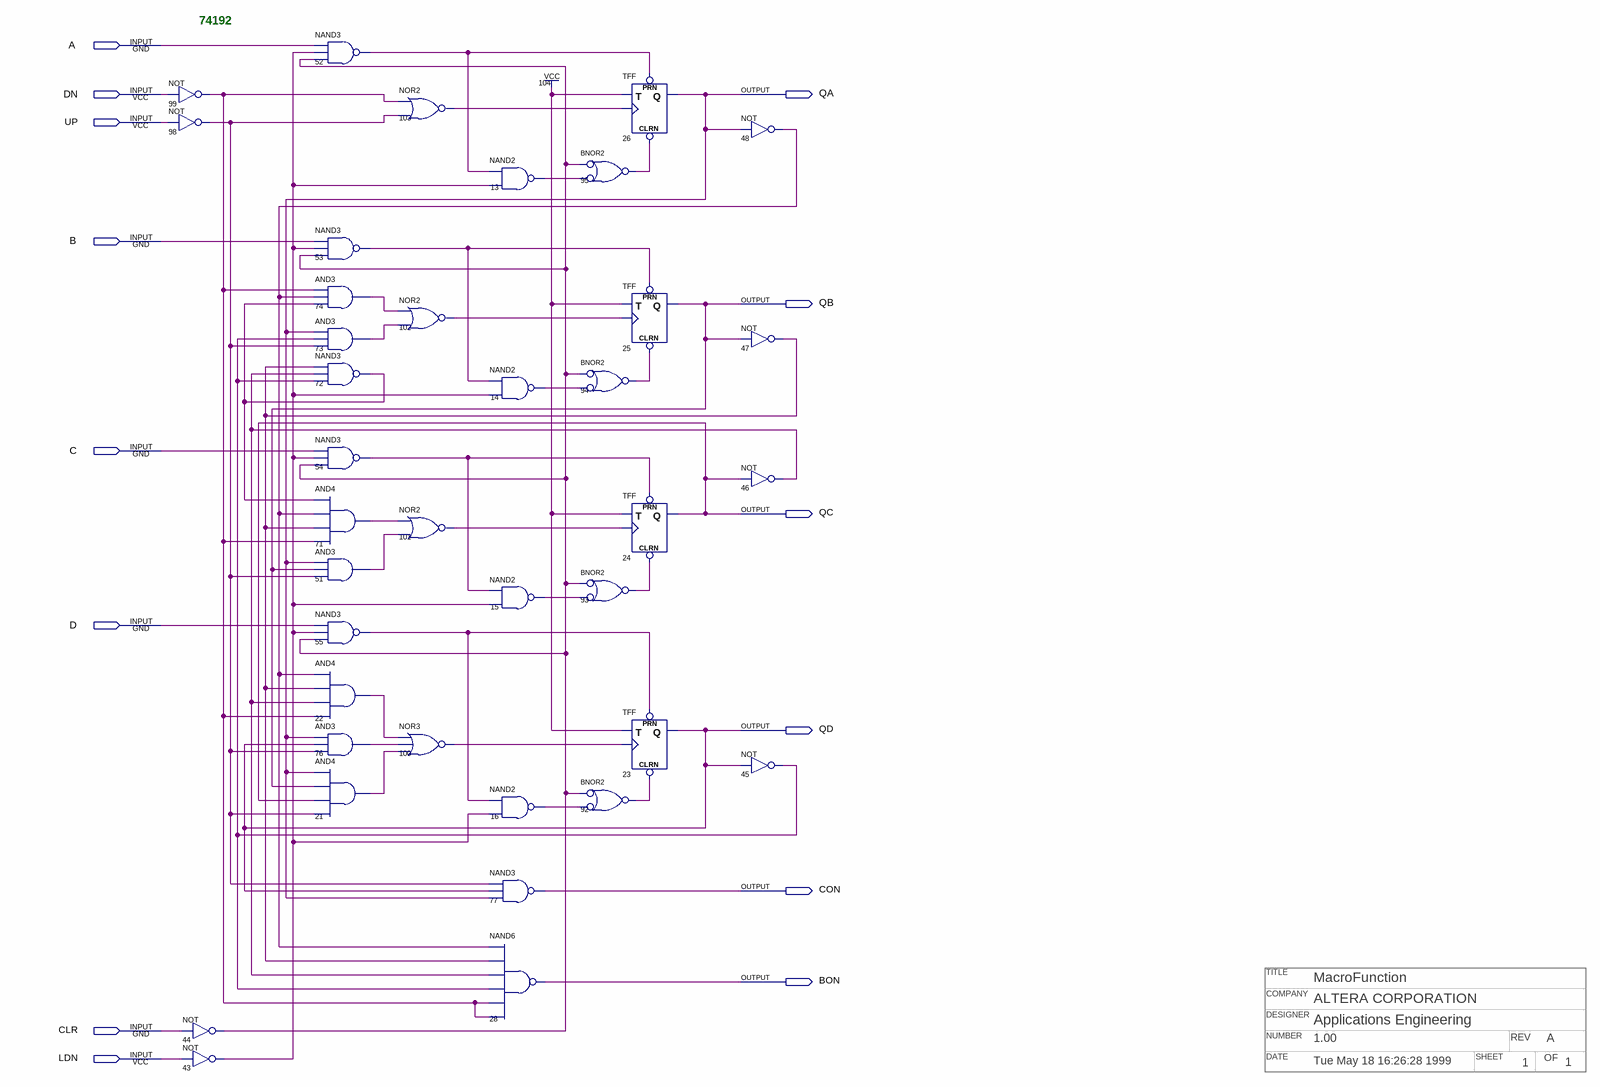
[diagram p0: schematic sheet]
// Quartus schematic 74192.bdf as structural Verilog: 38 symbols, 14 pins
// Title block: TITLE: MacroFunction; COMPANY: ALTERA CORPORATION; DESIGNER: Applications Engineering; NUMBER: 1.00; REV: A; DATE: Tue May 18 16:26:28 1999; SHEET: 1; OF: 1
module \74192  (
  input  A,
  input  DN,
  input  UP,
  input  B,
  input  C,
  input  D,
  input  CLR,
  input  LDN,
  output QA,
  output QB,
  output QC,
  output QD,
  output CON,
  output BON
);

  wire n13_out, n14_out, n15_out, n16_out, n21_out, n22_out, n43_out, n44_out, n45_out, n46_out, n47_out,
       n48_out, n51_out, n52_out, n53_out, n54_out, n55_out, n71_out, n72_out, n73_out, n74_out, n76_out,
       n92_out, n93_out, n94_out, n95_out, n98_out, n99_out, n100_out, n101_out, n102_out, n103_out;

  not u_99 (n99_out, DN);
  not u_98 (n98_out, UP);
  not u_44 (n44_out, CLR);
  not u_43 (n43_out, LDN);
  nand u_52 (n52_out, A, n43_out, n44_out);
  nand u_53 (n53_out, B, n43_out, n44_out);
  and u_74 (n74_out, n99_out, n48_out, n72_out);
  and u_73 (n73_out, QA, n45_out, n98_out);
  nand u_72 (n72_out, n47_out, n46_out, n45_out);
  nand u_54 (n54_out, C, n43_out, n44_out);
  and u_71 (n71_out, n72_out, n48_out, n47_out, n99_out);
  and u_51 (n51_out, QA, QB, n98_out);
  nand u_55 (n55_out, D, n43_out, n44_out);
  and u_22 (n22_out, n48_out, n47_out, n46_out, n99_out);
  and u_76 (n76_out, QA, QD, n98_out);
  and u_21 (n21_out, QA, QB, QC, n98_out);
  nor u_103 (n103_out, n99_out, n98_out);
  nor u_102 (n102_out, n74_out, n73_out);
  nor u_101 (n101_out, n71_out, n51_out);
  nor u_100 (n100_out, n22_out, n76_out, n21_out);
  nand u_13 (n13_out, n52_out, n43_out);
  nand u_14 (n14_out, n53_out, n43_out);
  nand u_15 (n15_out, n54_out, n43_out);
  nand u_16 (n16_out, n55_out, n43_out);
  nand u_77 (CON, n98_out, QD, QA);
  nand u_28 (BON, n48_out, n47_out, n46_out, n45_out, n99_out, n99_out);
  nor u_95 (n95_out, ~n44_out, ~n13_out);  // BNOR2
  nor u_94 (n94_out, ~n44_out, ~n14_out);  // BNOR2
  nor u_93 (n93_out, ~n44_out, ~n15_out);  // BNOR2
  nor u_92 (n92_out, ~n44_out, ~n16_out);  // BNOR2
  TFF u_26 (.PRN(n52_out), .CLRN(n95_out), .T(1'b1), .CLK(n103_out), .Q(QA));
  TFF u_25 (.PRN(n53_out), .CLRN(n94_out), .T(1'b1), .CLK(n102_out), .Q(QB));
  TFF u_24 (.PRN(n54_out), .CLRN(n93_out), .T(1'b1), .CLK(n101_out), .Q(QC));
  TFF u_23 (.PRN(n55_out), .CLRN(n92_out), .T(1'b1), .CLK(n100_out), .Q(QD));
  not u_48 (n48_out, QA);
  not u_47 (n47_out, QB);
  not u_46 (n46_out, QC);
  not u_45 (n45_out, QD);

  // Notes on the sheet:
  //   74192
endmodule
